# Altium schematic sheet Power_Protection.SchDoc
size 199 x 149 mm; SheetNumber: 2; SheetTotal: 6
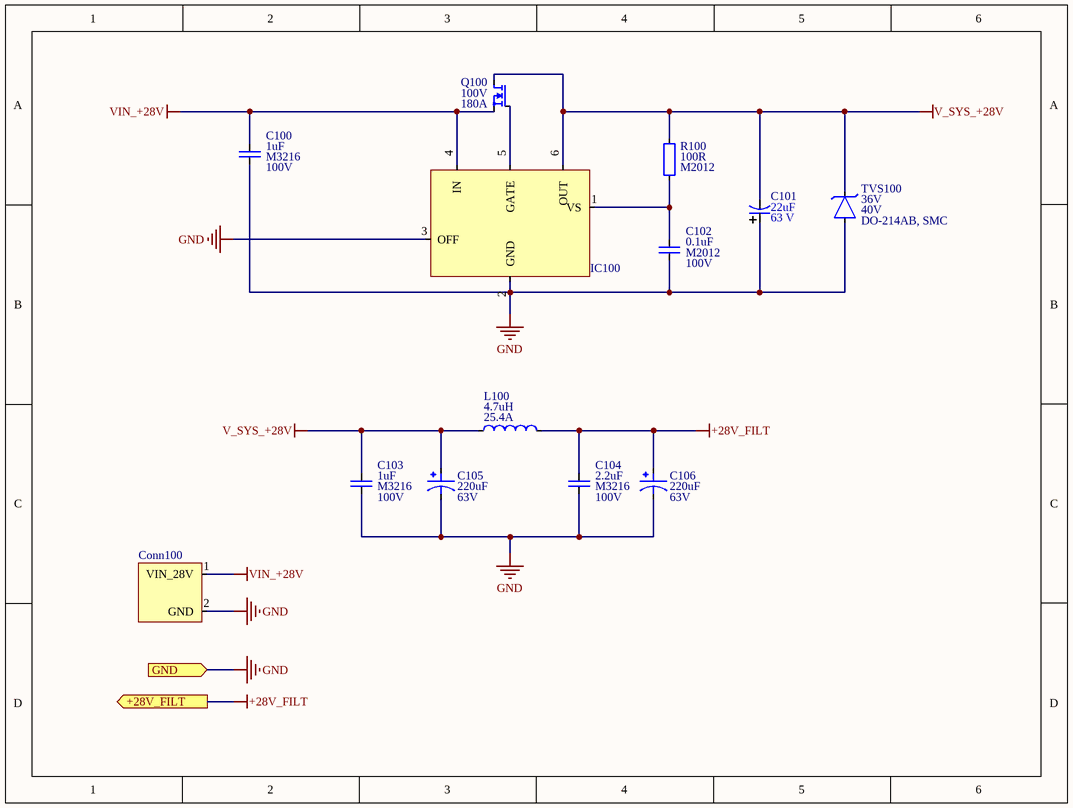
[diagram p0: Power_Protection.SchDoc]

## Parts
C100  value 1uF  Package: M3216  Rated Voltage: 100V  [Capacitor_Seramic_M3216_I1206]  (hidden comment: Capacitor_Seramic)
C101  value 22uF  Rated Voltage: 63 V  [PCAP_EEHZ_D8_PAN]  (hidden comment: Capacitor_Aluminum)
C102  value 0.1uF  Package: M2012  Rated Voltage: 100V  [Capacitor_Seramic_M2012_I0805]  (hidden comment: Capacitor_Seramic)
C103  value 1uF  Package: M3216  Rated Voltage: 100V  [Capacitor_Seramic_M3216_I1206]  (hidden comment: Capacitor_Seramic)
C104  value 2.2uF  Package: M3216  Rated Voltage: 100V  [Capacitor_Seramic_M3216_I1206]  (hidden comment: Capacitor_Seramic)
C105  value 220uF  Rated Voltage: 63V  [Capacitor_Aluminum_TH]  (hidden comment: Capacitor_Aluminum_TH)
C106  value 220uF  Rated Voltage: 63V  [Capacitor_Aluminum_TH]  (hidden comment: Capacitor_Aluminum_TH)
Conn100  KF128-2P  [Connector - KF128-5.08-2P]  (value not drawn)
IC100  Diodes, LM5050MK-1  [SOT-23-6Pin]  (value not drawn)
L100  value 4.7uH  Saturation Current: 25.4A  [Coilcraft - XAL1010-472MED]  (hidden comment: Inductor)
Q100  Current: 180A  Voltage: 100V  [TO263-7, Mosfet - Type 1]  (hidden comment: Mosfet, N-Channel - IPB017N10N5)
R100  value 100R  Package: M2012  [Resistor_SMD_M2012_I0805]  (hidden comment: Resistor)
TVS100  Voltage, Break Down: 40V  Voltage, Stand Off: 36V  Package: DO-214AB, SMC  [Diode_SMC_DO-214AB]  (hidden comment: Diode_Tvs)

## Ports
+28V_FILT (out), GND (in)

## Nets
+28V_FILT: C104.1 C106.P L100.1 ; port +28V_FILT
GND: C100.2 C101.1 C102.2 C103.2 C104.2 C105.N C106.N Conn100.2(GND) IC100.2(GND) IC100.3(OFF) TVS100.A ; port GND
V_SYS_+28V: C101.2 C103.1 C105.P IC100.6(OUT) L100.2 Q100.D R100.1 TVS100.K
VIN_+28V: C100.1 Conn100.1(VIN_28V) IC100.4(IN) Q100.S
NetC102_1: C102.1 IC100.1(VS) R100.2
NetIC100_5: IC100.5(GATE) Q100.G

## Library data of the parts
C100 C103 = Capacitor_Seramic: Cap, Cer, 1uF, 100V, M3216; Manufacturer Part Number: C3216X7R2A105K160AA; Manufacturer: TDK Corporation; Tolerance: ±10%; Temperature Coefficient: X7R; ComponentLink1Description: Datasheet; ComponentLink1URL: *; ComponentLink2Description: Supplier Link; ComponentLink2URL: https://www.digikey.com/en/products/detail/tdk-corporation/C3216X7R2A105K160AA/2042138; Supplier Part Number: 445-4467-1-ND; Supplier Link: https://www.digikey.com/en/products/detail/tdk-corporation/C3216X7R2A105K160AA/2042138; Supplier Currency: $; Supplier: Digikey; Quantity, Min: 1; Quantity, Max: 1,000; Price, Min: $0.41000; Price, Max: $0.12024; Operating Temperature, Min: -55℃; Operating Temperature, Max: +125℃; Component Type: Ceramic; Component Category: Capacitor
C101 = Capacitor_Aluminum: Cap, Aluminum; Manufacturer: Panasonic; Manufacturer Part Number: EEH-ZA1J220XP; Tolerance: ±20%; Component Category: Capacitors; ComponentLink1Description: Supplier Link; ComponentLink1URL: https://www.digikey.com/en/products/detail/panasonic-electronic-components/EEH-ZA1J220XP/3088130; Temperature Coefficient: *; Component Type: Aluminum; Operating Temperature, Max: +105°C; Operating Temperature, Min: -55°C; Price, Max: $0.85740; Price, Min: $2.04000; Quantity, Max: 100; Quantity, Min: 1; Supplier: Digikey; Supplier Currency: $; Supplier Link: https://www.digikey.com/en/products/detail/panasonic-electronic-components/EEH-ZA1J220XP/3088130; Supplier Part Number: P15447CT-ND; Package: *
C102 = Capacitor_Seramic: Cap, Cer, 0.1uF, 100V, M2012; Manufacturer Part Number: C2012X7R2A104K125AA; Manufacturer: TDK Corporation; Tolerance: ±10%; Temperature Coefficient: X7R; ComponentLink1Description: Datasheet; ComponentLink1URL: *; ComponentLink2Description: Supplier Link; ComponentLink2URL: https://www.digikey.com/en/products/detail/tdk-corporation/C2012X7R2A104K125AA/569044; Supplier Part Number: 445-1418-1-ND; Supplier Link: https://www.digikey.com/en/products/detail/tdk-corporation/C2012X7R2A104K125AA/569044; Supplier Currency: $; Supplier: Digikey; Quantity, Min: 1; Quantity, Max: 1,000; Price, Min: $0.16000; Price, Max: $0.03714; Operating Temperature, Min: -55℃; Operating Temperature, Max: +125℃; Component Type: Ceramic; Component Category: Capacitor
C104 = Capacitor_Seramic: Cap, Cer, 2.2uF, 100V, M3216; Manufacturer Part Number: AC1206KKX7R0BB225; Manufacturer: YAGEO; Tolerance: ±10%; Temperature Coefficient: X7R; ComponentLink1Description: Datasheet; ComponentLink1URL: *; ComponentLink2Description: Supplier Link; ComponentLink2URL: https://www.digikey.com/en/products/detail/yageo/AC1206KKX7R0BB225/16797723; Supplier Part Number: 13-AC1206KKX7R0BB225CT-ND; Supplier Link: https://www.digikey.com/en/products/detail/yageo/AC1206KKX7R0BB225/16797723; Supplier Currency: $; Supplier: Digikey; Quantity, Min: 1; Quantity, Max: 1,000; Price, Min: $1.08000; Price, Max: $0.39533; Operating Temperature, Min: -55℃; Operating Temperature, Max: +125℃; Component Type: Ceramic; Component Category: Capacitor
C105 C106 = Capacitor_Aluminum_TH: 220F 63V Aluminum Electrolytic Capacitors Radial, Can 10000 Hrs @ 105C; Manufacturer: Panasonic Electronic Components; Manufacturer Part Number: EEU-FR1J221L; Tolerance: ±20%; Temperature Coefficient: *; Component Category: Aluminum; Component Type: Capacitor; Operating Temperature, Max: +105°C; Operating Temperature, Min: -40°C; ComponentLink1Description: Supplier Link; ComponentLink1URL: https://www.digikey.com/en/products/detail/panasonic-electronic-components/EEU-FR1J221L/3072289; Supplier Part Number: P15409-ND; Supplier Link: https://www.digikey.com/en/products/detail/panasonic-electronic-components/EEU-FR1J221L/3072289; Supplier Currency: $; Supplier: Digikey; Quantity, Min: 1; Quantity, Max: 600; Price, Min: $1.45000; Price, Max: $0.54887
Conn100 = Connector - 2P
IC100 = Diodes, LM5050MK-1: IC, Power, DC-DC, TI, LM5050MK-1; Manufacturer: Texas Instruments; Manufacturer Part Number: LM5050MK-1/NOPB; ComponentLink1Description: Datasheet; ComponentLink1URL: C:\Users\User\OneDrive - Karadeniz Teknik University\Masaüstü\pcb\kütüphane\Datasheet\lm5050-1.pdf; ComponentLink2Description: Supplier Link; ComponentLink2URL: https://www.digikey.com/en/products/detail/texas-instruments/LM5050MK-1-NOPB/2673199; Supplier Part Number: LM5050MK-1/NOPBCT-ND; Supplier Link: https://www.digikey.com/en/products/detail/texas-instruments/LM5050MK-1-NOPB/2673199; Supplier Currency: $; Supplier: Digikey; Quantity, Min: 1; Quantity, Max: 500; Price, Min: $2.72000; Price, Max: $1.52192; Operating Temperature, Min: -40℃; Operating Temperature, Max: +85℃; Component Type: IC; Component Category: Power; Package: SOT-23
L100 = Inductor: Manufacturer Part Number: XAL1010-472MED; Manufacturer: Coilcraft; ComponentLink1Description: Datasheet; ComponentLink1URL: *; ComponentLink2Description: Supplier Link; ComponentLink2URL: https://www.digikey.com/en/products/detail/coilcraft/XAL1010-472MED/15794568; Component Category: Inductor; Component Type: Power Inductor; Supplier Link: https://www.digikey.com/en/products/detail/coilcraft/XAL1010-472MED/15794568; Supplier Currency: $; Price, Max: $5.32500; Price, Min: $8.12000; Quantity, Max: 300; Quantity, Min: 1; Operating Temperature, Max: +165℃; Operating Temperature, Min: -40℃; Supplier Part Number: 2457-XAL1010-472MED-ND; Supplier: Digikey; Package: Nonstandard
Q100 = Mosfet, N-Channel - IPB017N10N5: Manufacturer Part Number: IPB017N10N5ATMA1; Manufacturer: Infineon Technologies; Component Category: Transistor; ComponentLink1Description: Datasheet; ComponentLink1URL: C:\Users\User\OneDrive - Karadeniz Teknik University\Masaüstü\pcb\kütüphane\Datasheet\infineon-ipb017n10n5-datasheet-en.pdf; ComponentLink2Description: Supplier Link; ComponentLink2URL: https://www.digikey.com/en/products/detail/infineon-technologies/IPB017N10N5ATMA1/5213937; Supplier: Digikey; Supplier Part Number: IPB017N10N5ATMA1CT-ND; Operating Temperature, Min: -55℃; Operating Temperature, Max: +175℃; Quantity, Min: 1; Quantity, Max: 500; Price, Min: $6.24000; Price, Max: $3.01226; Supplier Currency: $; Supplier Link: https://www.digikey.com/en/products/detail/infineon-technologies/IPB017N10N5ATMA1/5213937; Component Type: Mosfet; Package: TO263-7
R100 = Resistor: Res, 100R, 1%, M2012; Manufacturer: Yageo; Manufacturer Part Number: RC0805FR-07100RL; Supplier: Digikey; Supplier Part Number: 311-100CRCT-ND; Operating Temperature, Min: -55℃; Operating Temperature, Max: +155℃; Quantity, Min: 1; Quantity, Max: 50; Price, Min: $0.12000; Price, Max: $0.00820; Supplier Currency: $; Supplier Link: https://www.digikey.com/en/products/detail/yageo/RC0805FR-07100RL/727543; Tolerance: 1%; Component Type: Fixed Value; Component Category: Resistor; ComponentLink1Description: Datasheet; ComponentLink1URL: *; ComponentLink2Description: Supplier Link; ComponentLink2URL: https://www.digikey.com/en/products/detail/yageo/RC0805FR-07100RL/727543
TVS100 = Diode_Tvs: Manufacturer Part Number: 5.0SMDJ36A; Manufacturer: Littelfuse Inc.; Component Category: Diode; ComponentLink1Description: Datasheet; ComponentLink1URL: C:\Users\User\OneDrive - Karadeniz Teknik University\Masaüstü\pcb\kütüphane\Datasheet\Littelfuse-TVS-Diode-5-0SMDJ-Datasheet-20250624.pdf; ComponentLink2Description: Supplier Link; ComponentLink2URL: https://www.digikey.com/en/products/detail/littelfuse-inc/5-0SMDJ36A/2024330; Supplier: Digikey; Supplier Part Number: F4121CT-ND; Operating Temperature, Min: +150℃; Operating Temperature, Max: -65℃; Quantity, Min: 1; Quantity, Max: 1,000; Price, Min: $1.24000; Price, Max: $0.76734; Supplier Currency: $; Supplier Link: https://www.digikey.com/en/products/detail/littelfuse-inc/5-0SMDJ36A/2024330; Component Type: Zener